# EAGLE schematic Application - out8 16A - bistable relay - 4TE - BOT (EAGLE 6.3)
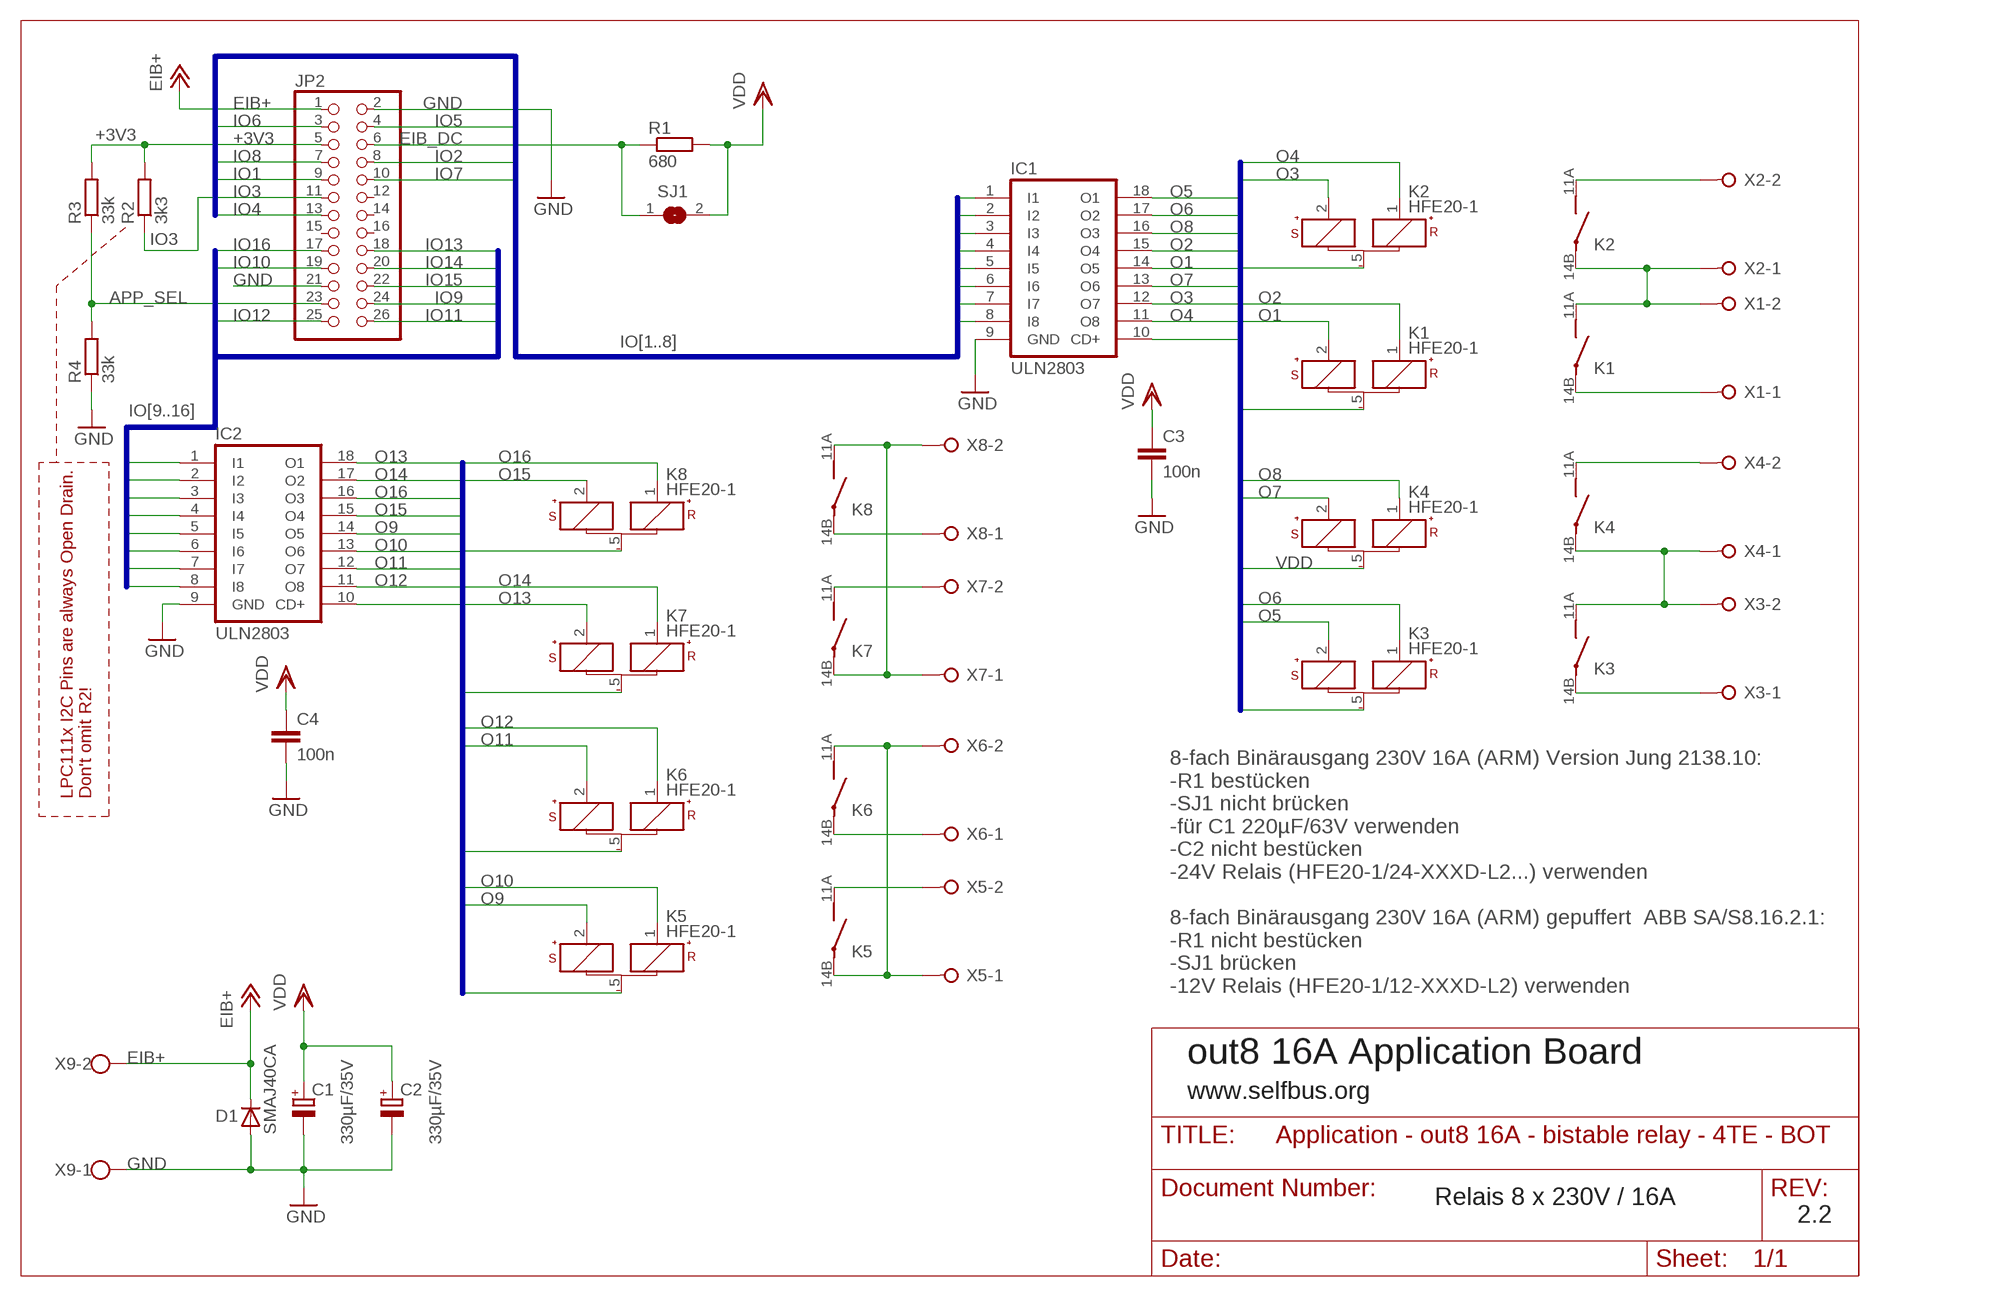
[diagram p0: schematic, sheet 1]

## Parts
C1  330µF/35V  CPOL-EUE3.5-8  [E3,5-8]
C2  330µF/35V  CPOL-EUE3.5-8  [E3,5-8]
C3  100n  C-EUC1206  [C1206]
C4  100n  C-EUC1206  [C1206]
D1  SMAJ40CA  D-SMB  [SMB]
IC1  ULN2803  ULN2803ASOP18  [SO18W]
IC2  ULN2803  ULN2803ASOP18  [SO18W]
JP2  PINHD-2X13_2.54-SMD  [2X13SMD]
K1  HFE20-1  HFE20-1-024-1HD504  [HFE20-3-504]
K2  HFE20-1  HFE20-1-024-1HD504  [HFE20-3-504]
K3  HFE20-1  HFE20-1-024-1HD504  [HFE20-3-504]
K4  HFE20-1  HFE20-1-024-1HD504  [HFE20-3-504]
K5  HFE20-1  HFE20-1-024-1HD504  [HFE20-3-504]
K6  HFE20-1  HFE20-1-024-1HD504  [HFE20-3-504]
K7  HFE20-1  HFE20-1-024-1HD504  [HFE20-3-504]
K8  HFE20-1  HFE20-1-024-1HD504  [HFE20-3-504]
R1  680  R-EU_M1206  [M1206]
R2  3k3  R-EU_M1206  [M1206]
R3  33k  R-EU_M1206  [M1206]
R4  33k  R-EU_M1206  [M1206]
SJ1  SJ  [SJ]
X1  W237-02P  [W237-132]
X2  W237-02P  [W237-132]
X3  W237-02P  [W237-132]
X4  W237-02P  [W237-132]
X5  W237-02P  [W237-132]
X6  W237-02P  [W237-132]
X7  W237-02P  [W237-132]
X8  W237-02P  [W237-132]
X9  W237-102  [W237-102]

## Nets
+3V3: JP2.5 R2.2 R3.2
APP_SEL: JP2.23 R3.1 R4.2
EIB+: D1.1(C) JP2.1 X9.2
EIB_DC: JP2.6 R1.1 SJ1.1
GND: C1.- C2.- C3.2 C4.2 D1.2(A) IC1.9(GND) IC2.9(GND) JP2.2 JP2.21 R4.1 X9.1
IO1: IC1.5(I5) JP2.9
IO2: IC1.4(I4) JP2.8
IO3: IC1.7(I7) JP2.11 R2.1
IO4: IC1.8(I8) JP2.13
IO5: IC1.1(I1) JP2.4
IO6: IC1.2(I2) JP2.3
IO7: IC1.6(I6) JP2.10
IO8: IC1.3(I3) JP2.7
IO9: IC2.5(I5) JP2.24
IO10: IC2.6(I6) JP2.19
IO11: IC2.7(I7) JP2.26
IO12: IC2.8(I8) JP2.25
IO13: IC2.1(I1) JP2.18
IO14: IC2.2(I2) JP2.20
IO15: IC2.4(I4) JP2.22
IO16: IC2.3(I3) JP2.17
K12: K1.11A(PB) K2.14B(PA) X1.2 X2.1
K34: K3.11A(PB) K4.14B(PA) X3.2 X4.1
K56: K5.14B(PA) K6.11A(PB) X5.1 X6.2
K78: K7.14B(PA) K8.11A(PB) X7.1 X8.2
N$1: K4.11A(PB) X4.2
N$2: K8.14B(PA) X8.1
N$3: K1.14B(PA) X1.1
N$4: K3.14B(PA) X3.1
N$8: K2.11A(PB) X2.2
N$11: K7.11A(PB) X7.2
N$13: K5.11A(PB) X5.2
N$14: K6.14B(PA) X6.1
O1: IC1.14(O5) K1.2(S+)
O2: IC1.15(O4) K1.1(R+)
O3: IC1.12(O7) K2.2(S+)
O4: IC1.11(O8) K2.1(R+)
O5: IC1.18(O1) K3.2(S+)
O6: IC1.17(O2) K3.1(R+)
O7: IC1.13(O6) K4.2(S+)
O8: IC1.16(O3) K4.1(R+)
O9: IC2.14(O5) K5.2(S+)
O10: IC2.13(O6) K5.1(R+)
O11: IC2.12(O7) K6.2(S+)
O12: IC2.11(O8) K6.1(R+)
O13: IC2.18(O1) K7.2(S+)
O14: IC2.17(O2) K7.1(R+)
O15: IC2.15(O4) K8.2(S+)
O16: IC2.16(O3) K8.1(R+)
VDD: C1.+ C2.+ C3.1 C4.1 IC1.10(CD+) IC2.10(CD+) K1.5(-) K2.5(-) K3.5(-) K4.5(-) K5.5(-) K6.5(-) K7.5(-) K8.5(-) R1.2 SJ1.2
Unconnected: JP2.12 JP2.14 JP2.15 JP2.16

## Buses
IO[1..8]
IO[9..16]
B$1
B$2

## Notes on the sheet
- LPC111x I2C Pins are always Open Drain.
  Don't omit R2!
- 8-fach Binärausgang 230V 16A (ARM) Version Jung 2138.10:
  -R1 bestücken
  -SJ1 nicht brücken
  -für C1 220µF/63V verwenden
  -C2 nicht bestücken
  -24V Relais (HFE20-1/24-XXXD-L2...) verwenden
  
  8-fach Binärausgang 230V 16A (ARM) gepuffert  ABB SA/S8.16.2.1:
  -R1 nicht bestücken
  -SJ1 brücken
  -12V Relais (HFE20-1/12-XXXD-L2) verwenden
- out8 16A Application Board
- www.selfbus.org
- Relais 8 x 230V / 16A
- 2.2

## Library data of the parts
C1 C2 = rcl:CPOL-EU: POLARIZED CAPACITOR, European symbol
C3 C4 = rcl:C-EU: CAPACITOR, European symbol
D1 = semicon-smd-ipc:D-: DIODE unfilled
IC1 IC2 = uln-udn:ULN2803A: DRIVER ARRAY
JP2 = pinhead:PINHD-2X13: PIN HEADER
K1-K8 = sb-relay:HFE20-1-024-1HD
R1-R4 = rcl:R-EU_: RESISTOR, European symbol
SJ1 = jumper:SJ: SMD solder JUMPER
X1-X8 = con-wago-508:W237-02P: WAGO SREW CLAMP; OC_FARNELL: unknown; OC_NEWARK: unknown
X9 = con-wago-500:W237-102: WAGO SCREW CLAMP

## Net classes
1 230Vac: width 1.93 mm, clearance 5.08 mm to class 0, clearance 1.905 mm